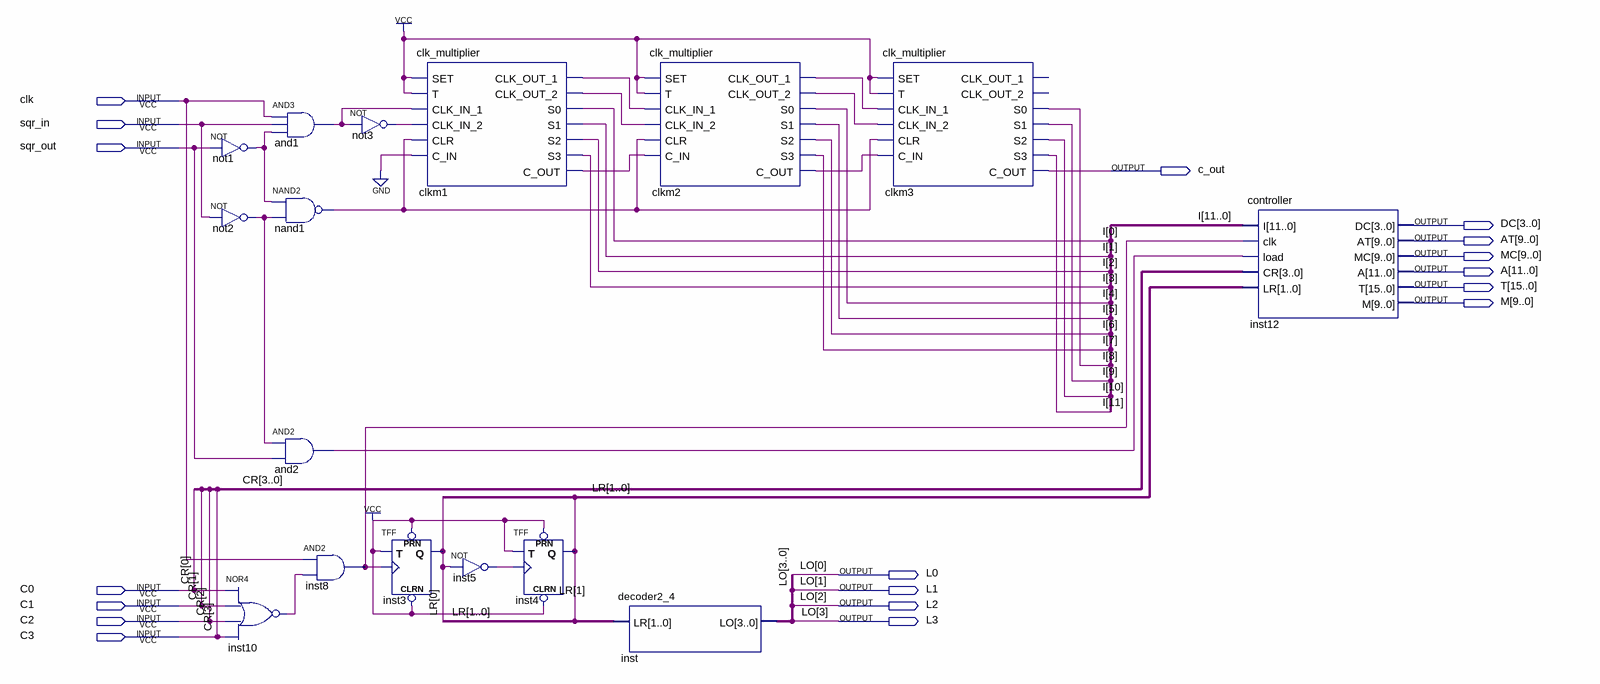
[diagram p0: schematic sheet]
// Quartus schematic nmm.bdf as structural Verilog: 16 symbols, 18 pins
module nmm (
  input  clk,
  input  sqr_in,
  input  sqr_out,
  input  C0,
  input  C1,
  input  C2,
  input  C3,
  output c_out,
  output [3:0] DC,
  output [9:0] AT,
  output [9:0] MC,
  output [11:0] A,
  output [15:0] T,
  output [9:0] M,
  output L0,
  output L1,
  output L2,
  output L3
);

  wire and1_out, and2_out, clkm1_c_out, clkm1_clk_out_1, clkm1_clk_out_2, clkm2_c_out, clkm2_clk_out_1,
       clkm2_clk_out_2, inst5_out, inst8_out, inst10_out, nand1_out, not1_out, not2_out, not3_out;
  wire [1:0] LR;
  wire [11:0] I;

  not not1 (not1_out, sqr_out);
  not not2 (not2_out, sqr_in);
  nor inst10 (inst10_out, C0, C1, C2, C3);
  and and1 (and1_out, clk, sqr_in, not1_out);
  nand nand1 (nand1_out, not1_out, not2_out);
  and and2 (and2_out, not2_out, sqr_out);
  and inst8 (inst8_out, clk, inst10_out);
  not not3 (not3_out, and1_out);
  clk_multiplier clkm1 (
    .SET(1'b1), .T(1'b1), .CLK_IN_1(and1_out), .CLK_IN_2(not3_out), .CLR(nand1_out), .C_IN(1'b0),
    .CLK_OUT_1(clkm1_clk_out_1), .CLK_OUT_2(clkm1_clk_out_2), .S3(I[3]), .C_OUT(clkm1_c_out), .S0(I[0]),
    .S1(I[1]), .S2(I[2]));
  TFF inst3 (.PRN(1'b1), .CLRN(1'b1), .T(1'b1), .CLK(inst8_out), .Q(LR[0]));
  not inst5 (inst5_out, LR[0]);
  TFF inst4 (.PRN(1'b1), .CLRN(1'b1), .T(1'b1), .CLK(inst5_out), .Q(LR[1]));
  decoder2_4 inst (.LR(LR), .LO({L3, L2, L1, L0}));
  clk_multiplier clkm2 (
    .SET(1'b1), .T(1'b1), .CLK_IN_1(clkm1_clk_out_1), .CLK_IN_2(clkm1_clk_out_2), .CLR(nand1_out),
    .C_IN(clkm1_c_out), .CLK_OUT_1(clkm2_clk_out_1), .CLK_OUT_2(clkm2_clk_out_2), .S3(I[7]),
    .C_OUT(clkm2_c_out), .S0(I[4]), .S1(I[5]), .S2(I[6]));
  clk_multiplier clkm3 (
    .SET(1'b1), .T(1'b1), .CLK_IN_1(clkm2_clk_out_1), .CLK_IN_2(clkm2_clk_out_2), .CLR(nand1_out),
    .C_IN(clkm2_c_out), .S3(I[11]), .C_OUT(c_out), .S0(I[8]), .S1(I[9]), .S2(I[10]));  // open: CLK_OUT_1, CLK_OUT_2
  controller inst12 (
    .I(I), .clk(inst8_out), .load(and2_out), .CR({C3, C2, C1, C0}), .LR(LR), .DC(DC), .AT(AT), .MC(MC),
    .A(A), .T(T), .M(M));

  // Other names for the same wires on the sheet: CR[3:0] = {C3, C2, C1, C0}; LO[3:0] = {L3, L2, L1, L0}
endmodule
